# Altium project Trabajo Final.PrjPcb (part 3 of 4)

## Sheet arm.SchDoc
size A4
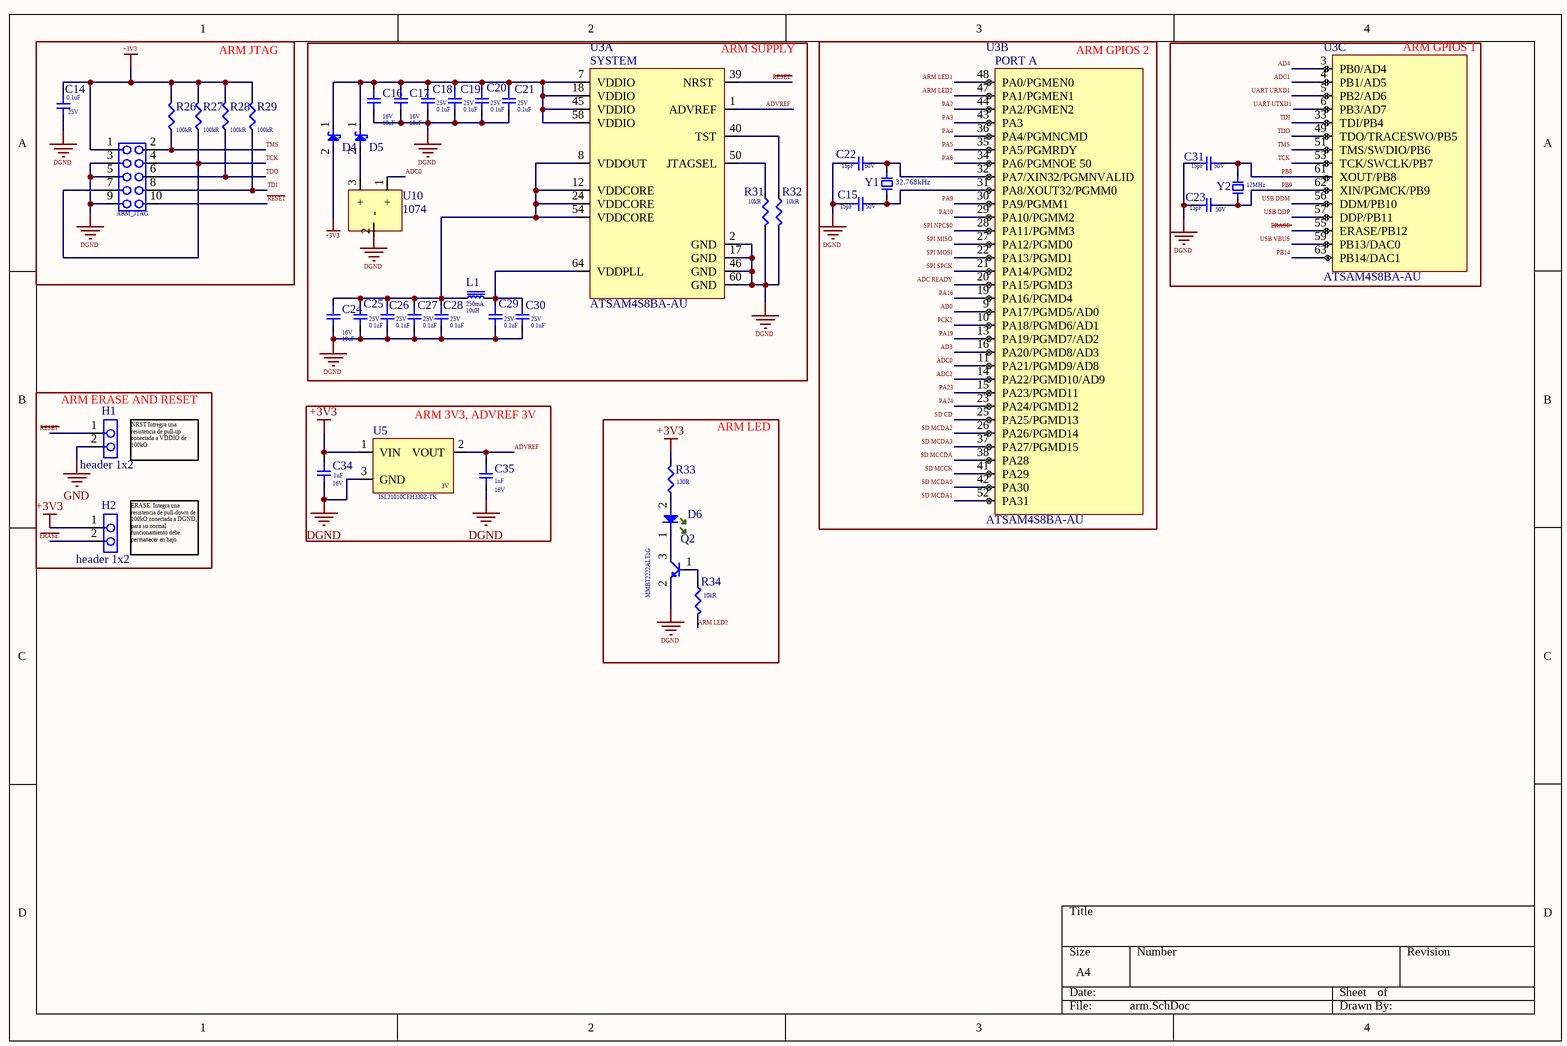
[diagram p3: arm.SchDoc]

### Parts
ARM_JTAG  20021121-00010C4LF  [conector jtag ok]  (value not drawn)
C14  Voltage Rating: 25V  Capacitance: 0.1uF  [CAP smd 0805 ok]  (hidden comment: CAP_CC0805KRX7R8BB104_YAGEO)
C15  Voltage Rating: 50V  Capacitance: 15pF  [CAP smd 0805 ok]  (hidden comment: CAP_C0805X150J5GACTU_KEMET)
C16  Voltage Rating: 16V  Capacitance: 10uF  [CAP smd 0805 OK]  (hidden comment: CAP_CL21A106KOCL3RC)
C17  Voltage Rating: 16V  Capacitance: 10uF  [CAP smd 0805 OK]  (hidden comment: CAP_CL21A106KOCL3RC)
C18  Voltage Rating: 25V  Capacitance: 0.1uF  [CAP smd 0805 ok]  (hidden comment: CAP_CC0805KRX7R8BB104_YAGEO)
C19  Voltage Rating: 25V  Capacitance: 0.1uF  [CAP smd 0805 ok]  (hidden comment: CAP_CC0805KRX7R8BB104_YAGEO)
C20  Voltage Rating: 25V  Capacitance: 0.1uF  [CAP smd 0805 ok]  (hidden comment: CAP_CC0805KRX7R8BB104_YAGEO)
C21  Voltage Rating: 25V  Capacitance: 0.1uF  [CAP smd 0805 ok]  (hidden comment: CAP_CC0805KRX7R8BB104_YAGEO)
C22  Voltage Rating: 50V  Capacitance: 15pF  [CAP smd 0805 ok]  (hidden comment: CAP_C0805X150J5GACTU_KEMET)
C23  Voltage Rating: 50V  Capacitance: 15pF  [CAP smd 0805 ok]  (hidden comment: CAP_C0805X150J5GACTU_KEMET)
C24  Voltage Rating: 16V  Capacitance: 10uF  [CAP smd 0805 OK]  (hidden comment: CAP_CL21A106KOCL3RC)
C25  Voltage Rating: 25V  Capacitance: 0.1uF  [CAP smd 0805 ok]  (hidden comment: CAP_CC0805KRX7R8BB104_YAGEO)
C26  Voltage Rating: 25V  Capacitance: 0.1uF  [CAP smd 0805 ok]  (hidden comment: CAP_CC0805KRX7R8BB104_YAGEO)
C27  Voltage Rating: 25V  Capacitance: 0.1uF  [CAP smd 0805 ok]  (hidden comment: CAP_CC0805KRX7R8BB104_YAGEO)
C28  Voltage Rating: 25V  Capacitance: 0.1uF  [CAP smd 0805 ok]  (hidden comment: CAP_CC0805KRX7R8BB104_YAGEO)
C29  Voltage Rating: 25V  Capacitance: 0.1uF  [CAP smd 0805 ok]  (hidden comment: CAP_CC0805KRX7R8BB104_YAGEO)
C30  Voltage Rating: 25V  Capacitance: 0.1uF  [CAP smd 0805 ok]  (hidden comment: CAP_CC0805KRX7R8BB104_YAGEO)
C31  Voltage Rating: 50V  Capacitance: 15pF  [CAP smd 0805 ok]  (hidden comment: CAP_C0805X150J5GACTU_KEMET)
C34  Voltage Rating: 16V  Capacitance: 1uF  [CAP smd 0805 ok]  (hidden comment: CAP_CC0805KKX7R7BB105_YAGEO)
C35  Voltage Rating: 16V  Capacitance: 1uF  [CAP smd 0805 ok]  (hidden comment: CAP_CC0805KKX7R7BB105_YAGEO)
D4  DB2J20900L  [Diode SMini2 ok]  (value not drawn)
D5  DB2J20900L  [Diode SMini2 ok]  (value not drawn)
D6  150080VS75000  [Diode smd 0805 green ok]  (value not drawn)
H1  header 1x2
H2  header 1x2
L1  Current Rating: 250mA  Inductance: 10uH  [Inductor smd 1812 ok]  (hidden comment: CM453232-100KL)
Q2  MMBT2222ALT1G  [transistor led ok]
R26  Resistance: 100kR  [res 0805 ok]  (hidden comment: AC0805JR-07100KL)
R27  Resistance: 100kR  [res 0805 ok]  (hidden comment: AC0805JR-07100KL)
R28  Resistance: 100kR  [res 0805 ok]  (hidden comment: AC0805JR-07100KL)
R29  Resistance: 100kR  [res 0805 ok]  (hidden comment: AC0805JR-07100KL)
R31  Resistance: 10kR  [res 0805 ok]  (hidden comment: RC0805JR-0710KL)
R32  Resistance: 10kR  [res 0805 ok]  (hidden comment: RC0805JR-0710KL)
R33  Resistance: 130R  [res 0805 ok]  (hidden comment: RC0805FR-07130RL)
R34  Resistance: 10kR  [res 0805 ok]  (hidden comment: RC0805JR-0710KL)
U3  ATSAM4S8BA-AU  [arm ok]  (parts A,B,C of 3)
U5  Reference Voltage: 3V  [3v reference ok]  (hidden comment: ISL21010CFH330Z-TK)
U10  1074  [pila]
Y1  Frequency: 32.768kHz  [clk 32k ok]  (hidden comment: ECS-.327-12.5-34S-TR)
Y2  Frequency: 12MHz  [clk 12M ok]  (hidden comment: ECS-120-20-3X-TR)

### Blocks framed on the sheet
ARM JTAG: ARM_JTAG C14 R26-R29
ARM SUPPLY: C16-C21 C24-C30 D4 D5 L1 R31 R32 U3 U10
ARM GPIOS 2: C15 C22 U3 Y1
ARM GPIOS 1: C23 C31 U3 Y2
ARM ERASE AND RESET: H1 H2
ARM 3V3, ADVREF 3V: C34 C35 U5
ARM LED: D6 Q2 R33 R34

### Nets
+3V3: ARM_JTAG.1 C14.23 C34.23 D4.2 H2.1 R26.2 R27.2 R28.2 R29.2 R33.2 U5.1(VIN)
DGND: ARM_JTAG.3 ARM_JTAG.5 ARM_JTAG.9 C14.22 C15.23 C16.22 C17.22 C18.22 C19.22 C20.22 C21.22 C22.23 C23.23 C24.22 C25.22 C26.22 C27.22 C28.22 C29.22 C30.22 C31.22 C34.22 C35.22 Q2.2 R31.1 R32.1 U3.2(GND) U3.17(GND) U3.46(GND) U3.60(GND) U5.3(GND)  [project net AGND]
GND: H1.2
AD0: U3.9(PA17/PGMD5/AD0)
AD3: U3.16(PA20/PGMD8/AD3)
AD4: U3.3(PB0/AD4)
ADC0: U3.11(PA21/PGMD9/AD8) U10.1(+)
ADC1: U3.4(PB1/AD5)
ADC2: U3.14(PA22/PGMD10/AD9)
ADC READY: U3.20(PA15/PGMD3)
ADVREF: C35.23 U3.1(ADVREF) U5.2(VOUT)
ARM LED1: U3.48(PA0/PGMEN0)
ARM LED2: R34.1 U3.47(PA1/PGMEN1)
ERASE: H2.2 U3.55(ERASE/PB12)
PA2: U3.44(PA2/PGMEN2)
PA3: U3.43(PA3)
PA4: U3.36(PA4/PGMNCMD)
PA5: U3.35(PA5/PGMRDY)
PA6: U3.34(PA6/PGMNOE_50)
PA9: U3.30(PA9/PGMM1)
PA10: U3.29(PA10/PGMM2)
PA16: U3.19(PA16/PGMD4)
PA19: U3.13(PA19/PGMD7/AD2)
PA23: U3.15(PA23/PGMD11)
PA24: U3.23(PA24/PGMD12)
PB8: C31.23 U3.61(XOUT/PB8) Y2.14
PB9: C23.22 U3.62(XIN/PGMCK/PB9) Y2.13
PB14: U3.63(PB14/DAC1)
PCK2: U3.10(PA18/PGMD6/AD1)
RESET: ARM_JTAG.10 H1.1 U3.39(NRST)
SD CD: U3.25(PA25/PGMD13)
SD MCCDA: U3.38(PA28)
SD MCCK: U3.41(PA29)
SD MCDA0: U3.42(PA30)
SD MCDA1: U3.52(PA31)
SD MCDA2: U3.26(PA26/PGMD14)
SD MCDA3: U3.37(PA27/PGMD15)
SPI MISO: U3.27(PA12/PGMD0)
SPI MOSI: U3.22(PA13/PGMD1)
SPI NPCS0: U3.28(PA11/PGMM3)
SPI SPCK: U3.21(PA14/PGMD2)
TCK: ARM_JTAG.4 ARM_JTAG.7 R27.1 U3.53(TCK/SWCLK/PB7)
TDI: ARM_JTAG.8 R29.1 U3.33(TDI/PB4)
TDO: ARM_JTAG.6 R28.1 U3.49(TDO/TRACESWO/PB5)
TMS: ARM_JTAG.2 R26.1 U3.51(TMS/SWDIO/PB6)
UART URXD1: U3.5(PB2/AD6)
UART UTXD1: U3.6(PB3/AD7)
USB DDM: U3.56(DDM/PB10)
USB DDP: U3.57(DDP/PB11)
USB VBUS: U3.59(PB13/DAC0)
NetC15_22: C15.22 U3.31(PA8/XOUT32/PGMM0) Y1.13
NetC16_23: C16.23 C17.23 C18.23 C19.23 C20.23 C21.23 D4.1 D5.1 U3.7(VDDIO) U3.18(VDDIO) U3.45(VDDIO) U3.58(VDDIO)
NetC22_22: C22.22 U3.32(PA7/XIN32/PGMNVALID) Y1.14
NetC24_23: C24.23 C25.23 C26.23 C27.23 C28.23 L1.1 U3.8(VDDOUT) U3.12(VDDCORE) U3.24(VDDCORE) U3.54(VDDCORE)
NetC29_23: C29.23 C30.23 L1.2 U3.64(VDDPLL)
NetD5_2: D5.2 U10.3(+)
NetD6_1: D6.1 Q2.3
NetD6_2: D6.2 R33.1
NetQ2_1: Q2.1 R34.2
NetR31_2: R31.2 U3.50(JTAGSEL)
NetR32_2: R32.2 U3.40(TST)

Not connected (* = marked no-connect by the designer): U10 2(-)

### Notes on the sheet
- (near H1) NRST:Intregra una resistencia de pull-up conectada a VDDIO de 100kO
- (near H2) ERASE: Integra una resistencia de pull-down de 100kO conectada a DGND, para su normal funcionamiento debe permanecer en bajo.
- Labels drawn without touching a wire or pin: DGND
- (in symbol ATSAM4S8BA-AU, part A) SYSTEM
- (in symbol ATSAM4S8BA-AU, part B) PORT A

### Library data of the parts
ARM_JTAG = 20021121-00010C4LF: Conn Unshrouded Header HDR 10 POS 1.27mm Solder ST Top Entry SMD Minitek127® T/R; Manufacturer 1: Amphenol ICC / FCI; Supplier 1: Digi-Key; Manufacturer Part Number 1: 20021121-00010C4LF; Stock 1: 0; Pricing 1: 1=0,91000, 10=0,76900, 100=0,69070 (USD); RoHS: No; ComponentLink1URL: https://datasheet.ciiva.com/11749/0900766b8118d62a-11749057.pdf?src-supplier=RSComponents; ComponentLink1Description: https://datasheet.ciiva.com/11749/0900766b8118d62a-11749057.pdf?src-supplier=RSComponents; Supplier Part Number 1: 609-3695-1-ND
C14 C18-C21 C25-C30 = CAP_CC0805KRX7R8BB104_YAGEO: CAPACITOR, 0805, 100NF, 25V, REEL 4000; Manufacturer 1: Yageo; Material: Ceramic; Tolerance: 10%; Dielectric: X7R; Insulation Resistance: 100GR; Supplier 1: Digi-Key; Manufacturer Part Number 1: CC0805KRX7R8BB104; Stock 1: 278639; Pricing 1: 1=0,12000, 10=0,08800, 50=0,04980, 100=0,04130, 500=0,02894, 1000=0,02396 (USD); RoHS: Yes; Mount: Surface Mount; Case/Package: 0805; Number of Pins: 2; Case Code (Metric): 2012; Case Code (Imperial): 0805; Min Operating Temperature: -55°C; Max Operating Temperature: 125°C; Package Quantity: 1; Packaging: Tape and Reel; Voltage Rating (DC): 25V; Termination: SMD/SMT; Resistor Type: Ceramic; Series: CC; Length: 2mm; Width: 0.049inch; Height: 0.85mm; Thickness: 0.033inch; Depth: 1.25mm; Radiation Hardening: No; REACH SVHC: No SVHC; Lead Free: Lead Free; Halogen Free: Halogen Free; RoHS Compliant: Yes; ComponentLink1URL: https://datasheet.ciiva.com/8034/70765-8034031.pdf?src-supplier=Element14; ComponentLink1Description: https://datasheet.ciiva.com/8034/70765-8034031.pdf?src-supplier=Element14; ComponentLink2URL: https://datasheet.ciiva.com/28450/1489800-28450789.pdf?src-supplier=Element14; ComponentLink2Description: https://datasheet.ciiva.com/28450/1489800-28450789.pdf?src-supplier=Element14; ComponentLink3URL: https://datasheet.ciiva.com/46430/1850775-46430166.pdf?src-supplier=Element14; ComponentLink3Description: https://datasheet.ciiva.com/46430/1850775-46430166.pdf?src-supplier=Element14; ComponentLink4URL: https://datasheet.ciiva.com/145/mlccorderingcode-145008.pdf?src-supplier=Digi-Key; ComponentLink4Description: https://datasheet.ciiva.com/145/mlccorderingcode-145008.pdf?src-supplier=Digi-Key; ComponentLink5URL: https://datasheet.ciiva.com/145/mlccorderingcode-145007.pdf?src-supplier=Digi-Key; ComponentLink5Description: https://datasheet.ciiva.com/145/mlccorderingcode-145007.pdf?src-supplier=Digi-Key; ComponentLink6URL: https://datasheet.ciiva.com/145/mlccorderingcode-145009.pdf?src-supplier=Digi-Key; ComponentLink6Description: https://datasheet.ciiva.com/145/mlccorderingcode-145009.pdf?src-supplier=Digi-Key; ComponentLink7URL: https://datasheet.ciiva.com/8034/1784427-8034030.pdf?src-supplier=Element14; ComponentLink7Description: https://datasheet.ciiva.com/8034/1784427-8034030.pdf?src-supplier=Element14; ComponentLink8URL: https://datasheet.ciiva.com/8034/1784427-8034029.pdf?src-supplier=Element14; ComponentLink8Description: https://datasheet.ciiva.com/8034/1784427-8034029.pdf?src-supplier=Element14; ComponentLink9URL: https://datasheet.ciiva.com/15189/getdatasheetpartid-330244-15189223.pdf?src-supplier=Verical; ComponentLink9Description: https://datasheet.ciiva.com/15189/getdatasheetpartid-330244-15189223.pdf?src-supplier=Verical; ComponentLink10URL: https://datasheet.ciiva.com/16625/upy-gphc-x7r-6-3v-to-50v-8-16625546.pdf?src-supplier=Avnet+Europe; ComponentLink10Description: https://datasheet.ciiva.com/16625/upy-gphc-x7r-6-3v-to-50v-8-16625546.pdf?src-supplier=Avnet+Europe; Supplier Part Number 1: 311-1141-1-ND
C15 C22 C23 C31 = CAP_C0805X150J5GACTU_KEMET: Multilayer Ceramic Capacitors MLCC - SMD/SMT 50volts 15pF 5% C0G; Manufacturer 1: KEMET; Supplier 1: Digi-Key; Manufacturer Part Number 1: C0805X150J5GACTU; Stock 1: 2348; Pricing 1: 1=0,33000, 10=0,23100, 50=0,16160, 100=0,13860, 500=0,10396, 1000=0,08778 (USD); RoHS: Yes; Mount: Surface Mount; Case/Package: 0805; Case Code (Imperial): 0805; Case Code (Metric): 2012; Dielectric Material: Ceramic; Min Operating Temperature: -55°C; Max Operating Temperature: 125°C; Package Quantity: 4000; Voltage Rating (DC): 50V; Tolerance: 5%; Packaging: Tape and Reel; Dielectric: C0G; Termination: SMD/SMT; Series: FT-CAP; Features: Soft Termination; Construction: Flat; Length: 0.083inch; Width: 1.25mm; Height: 0.78mm; Thickness: 0.035inch; Depth: 1.25mm; Radiation Hardening: No; RoHS Compliant: Yes; Lead Free: Lead Free; ComponentLink1URL: http://www.mouser.com/ds/2/212/KEM_C1062_C0G_FT-CAP_SMD-1101746.pdf?src-supplier=Mouser; ComponentLink1Description: http://www.mouser.com/ds/2/212/KEM_C1062_C0G_FT-CAP_SMD-1101746.pdf?src-supplier=Mouser; ComponentLink2URL: http://www.kemet.com/kemet/web/homepage/kechome.nsf/file/KEM_C1062_C0G_FT-CAP_SMD.pdf/$file/KEM_C1062_C0G_FT-CAP_SMD.pdf?src-supplier=Avnet; ComponentLink2Description: http://www.kemet.com/kemet/web/homepage/kechome.nsf/file/KEM_C1062_C0G_FT-CAP_SMD.pdf/$file/KEM_C1062_C0G_FT-CAP_SMD.pdf?src-supplier=Avnet; ComponentLink3URL: https://search.kemet.com/component-edge/download/specsheet/C0805X150J5GACTU.pdf?src-supplier=Digi-Key; ComponentLink3Description: https://search.kemet.com/component-edge/download/specsheet/C0805X150J5GACTU.pdf?src-supplier=Digi-Key; Supplier Part Number 1: 399-7428-1-ND
C16 C17 C24 = CAP_CL21A106KOCL3RC: CAP CER 10UF 16V X5R 0805; Manufacturer 1: Samsung; Tolerance: 10%; Supplier 1: Digi-Key; Manufacturer Part Number 1: CL21A106KOCL3RC; Stock 1: 0; RoHS: Yes; Mount: Surface Mount; Case/Package: 0805; Case Code (Metric): 2012; Case Code (Imperial): 0805; Min Operating Temperature: -55°C; Max Operating Temperature: 85°C; Package Quantity: 1; Packaging: Tape and Reel; Series: CL; Length: 0.079inch; Width: 0.049inch; Thickness: 0.037inch; RoHS Compliant: Yes; ComponentLink1URL: https://datasheet.ciiva.com/25796/cl21a106kocl3rc-25796224.pdf?src-supplier=Digi-Key; ComponentLink1Description: https://datasheet.ciiva.com/25796/cl21a106kocl3rc-25796224.pdf?src-supplier=Digi-Key; Supplier Part Number 1: 1276-2398-2-ND
C34 C35 = CAP_CC0805KKX7R7BB105_YAGEO: YAGEO   CC0805KKX7R7BB105   CERAMIC CAPACITOR, 1UF, 16V, X7R, 10%, 0805; Supplier 1: Digi-Key; Manufacturer 1: Yageo; Manufacturer Part Number 1: CC0805KKX7R7BB105; Stock 1: 516899; Pricing 1: 1=0,16000, 10=0,11700, 50=0,06640, 100=0,05500, 500=0,03858, 1000=0,03194 (USD); RoHS: Yes; Mount: Surface Mount; Case/Package: 0805; Case Code (Metric): 2012; Case Code (Imperial): 0805; Min Operating Temperature: -55°C; Max Operating Temperature: 125°C; Tolerance: 10%; Dielectric: X7R; Series: CC; Packaging: Tape and Reel; Package Quantity: 1; Termination: SMD/SMT; Voltage Rating (DC): 16V; Length: 2mm; Width: 0.049inch; Depth: 1.25mm; Thickness: 0.049inch; Radiation Hardening: No; REACH SVHC: No SVHC; Lead Free: Lead Free; Halogen Free: Halogen Free; RoHS Compliant: Yes; ComponentLink1URL: https://datasheet.ciiva.com/144/mlccorderingcode-144902.pdf?src-supplier=Digi-Key; ComponentLink1Description: https://datasheet.ciiva.com/144/mlccorderingcode-144902.pdf?src-supplier=Digi-Key; ComponentLink2URL: https://datasheet.ciiva.com/144/mlccorderingcode-144903.pdf?src-supplier=Digi-Key; ComponentLink2Description: https://datasheet.ciiva.com/144/mlccorderingcode-144903.pdf?src-supplier=Digi-Key; ComponentLink3URL: https://datasheet.ciiva.com/144/mlccorderingcode-144904.pdf?src-supplier=Digi-Key; ComponentLink3Description: https://datasheet.ciiva.com/144/mlccorderingcode-144904.pdf?src-supplier=Digi-Key; ComponentLink4URL: https://datasheet.ciiva.com/11464/upy-gphc-x7r-6-3v-to-50v-8-11464750.pdf?src-supplier=Avnet; ComponentLink4Description: https://datasheet.ciiva.com/11464/upy-gphc-x7r-6-3v-to-50v-8-11464750.pdf?src-supplier=Avnet; ComponentLink5URL: https://datasheet.ciiva.com/13173/upy-gp-np0-16v-to-50v-8-3714-13173254.pdf?src-supplier=Mouser; ComponentLink5Description: https://datasheet.ciiva.com/13173/upy-gp-np0-16v-to-50v-8-3714-13173254.pdf?src-supplier=Mouser; ComponentLink6URL: https://datasheet.ciiva.com/7978/1489800-7978201.pdf?src-supplier=Element14; ComponentLink6Description: https://datasheet.ciiva.com/7978/1489800-7978201.pdf?src-supplier=Element14; ComponentLink7URL: https://datasheet.ciiva.com/28450/1489800-28450750.pdf?src-supplier=Element14; ComponentLink7Description: https://datasheet.ciiva.com/28450/1489800-28450750.pdf?src-supplier=Element14; ComponentLink8URL: https://datasheet.ciiva.com/15189/getdatasheetpartid-251802-15189206.pdf?src-supplier=Verical; ComponentLink8Description: https://datasheet.ciiva.com/15189/getdatasheetpartid-251802-15189206.pdf?src-supplier=Verical; Supplier Part Number 1: 311-1365-1-ND
D4 D5 = DB2J20900L: PANASONIC - DB2J20900L - Schottky Rectifier, 20 V, 500 mA, Single, SOD-323F, 2 Pins, 500 mV; Manufacturer 1: Panasonic SSG; Max Reverse Current: 30uA; Forward Current: 500mA; Reverse Recovery Time: 2.4ns; Max Repetitive Reverse Voltage (Vrrm): 20V; Max Forward Surge Current (Ifsm): 3A; Forward Voltage: 500mV; Supplier 1: Allied Electronics; Manufacturer Part Number 1: DB2J20900L; Stock 1: 0; Pricing 1: 1=0,17400, 100=0,16600, 200=0,15100, 400=0,13600, 1000=0,12100 (USD); RoHS: Yes; Mount: Surface Mount; Number of Pins: 2; Contact Plating: Tin; Min Operating Temperature: -55°C; Max Operating Temperature: 125°C; Package Quantity: 1; Packaging: Tape and Reel; Average Rectified Current: 500mA; Peak Non-Repetitive Surge Current: 3A; Element Configuration: Single; Max Reverse Voltage (DC): 20V; Length: 1.7mm; Width: 1.25mm; Height: 0.7mm; REACH SVHC: Unknown; Lead Free: Lead Free; RoHS Compliant: Yes; ComponentLink1URL: https://datasheet.ciiva.com/7964/db2j209-bed-7964194.pdf?src-supplier=Element14; ComponentLink1Description: https://datasheet.ciiva.com/7964/db2j209-bed-7964194.pdf?src-supplier=Element14; ComponentLink2URL: https://datasheet.ciiva.com/22650/db2j209-bed-22650026.pdf?src-supplier=Farnell; ComponentLink2Description: https://datasheet.ciiva.com/22650/db2j209-bed-22650026.pdf?src-supplier=Farnell; ComponentLink3URL: https://datasheet.ciiva.com/22659/1912053-22659242.pdf?src-supplier=Element14; ComponentLink3Description: https://datasheet.ciiva.com/22659/1912053-22659242.pdf?src-supplier=Element14; Supplier Part Number 1: 70358466
D6 = 150080VS75000: LED GREEN CLEAR 0805 SMD; Manufacturer 1: Wurth Electronics; Luminous Intensity: 40mcd; Forward Current: 30mA; Forward Voltage: 2V; Viewing Angle: 140°; Wavelength: 570nm; Lens Style: Clear,Rectangular; Test Current: 20mA; Supplier 1: RSComponents; Manufacturer Part Number 1: 150080VS75000; Stock 1: 13900; Pricing 1: 500=0,09600, 1000=0,09200, 2000=0,08700, 4000=0,08300 (GBP); RoHS: Yes; Mount: Surface Mount; Case/Package: 0805; Color: Green; Case Code (Metric): 2012; Case Code (Imperial): 0805; Min Operating Temperature: -40°C; Max Operating Temperature: 85°C; Package Quantity: 4000; Packaging: Tape and Reel; Dominant Wavelength: 570nm; Length: 2mm; Width: 1.25mm; Height: 0.7mm; REACH SVHC: Unknown; ComponentLink1URL: https://datasheet.ciiva.com/22656/150080vs75000-22656966.pdf?src-supplier=Element14; ComponentLink1Description: https://datasheet.ciiva.com/22656/150080vs75000-22656966.pdf?src-supplier=Element14; ComponentLink2URL: https://datasheet.ciiva.com/29279/759437-da-01-en-chipled-0805-w-kl-h-gruen-150080vs7500-29279047.pdf?src-supplier=Conrad; ComponentLink2Description: https://datasheet.ciiva.com/29279/759437-da-01-en-chipled-0805-w-kl-h-gruen-150080vs7500-29279047.pdf?src-supplier=Conrad; ComponentLink3URL: https://datasheet.ciiva.com/29563/150080vs75000-29563018.pdf?src-supplier=Digi-Key; ComponentLink3Description: https://datasheet.ciiva.com/29563/150080vs75000-29563018.pdf?src-supplier=Digi-Key; Supplier Part Number 1: 8154237P
L1 = CM453232-100KL: Ind General Purpose Chip Wirewound 10uH 10% 2.52MHz 50Q-Factor Ferrite 250mA 1812 T/R; Manufacturer 1: Bourns; DC Resistance (DCR): 1.6R; Q Factor: 50; Self Resonant Frequency: 20MHz; Shielding: Unshielded; Current: 160mA; Supplier 1: Digi-Key; Manufacturer Part Number 1: CM453232-100KL; Stock 1: 1374; Pricing 1: 1=0,43000, 10=0,38100, 25=0,33320, 50=0,28540, 100=0,26170, 250=0,23788 (USD); RoHS: Yes; Mount: Surface Mount; Case/Package: 1812; Number of Pins: 2; Core Material: Ferrite; Case Code (Metric): 4532; Case Code (Imperial): 1812; Contact Plating: Tin; Min Operating Temperature: -40°C; Max Operating Temperature: 100°C; Tolerance: 10%; Max DC Current: 250mA; Packaging: Tape and Reel; Inductance Tolerance: 10%; Package Quantity: 500; Resistor Type: Wirewound; Test Frequency: 2.52MHz; Termination: SMD/SMT; DC Current: 250mA; Series Resistance: 1.6R; Series: CM453232; Length: 4.8mm; Width: 0.126inch; Height: 3mm; Height - Seated (Max): 0.134inch; Depth: 3.4mm; Radiation Hardening: No; REACH SVHC: No SVHC; Military Standard: Not; RoHS Compliant: Yes; ComponentLink1URL: https://datasheet.ciiva.com/27049/774461-27049974.pdf?src-supplier=Jameco; ComponentLink1Description: https://datasheet.ciiva.com/27049/774461-27049974.pdf?src-supplier=Jameco; ComponentLink2URL: https://datasheet.ciiva.com/11799/0900766b81218b74-11799714.pdf?src-supplier=RSComponents; ComponentLink2Description: https://datasheet.ciiva.com/11799/0900766b81218b74-11799714.pdf?src-supplier=RSComponents; ComponentLink3URL: https://datasheet.ciiva.com/29348/447189-da-01-en-induktivitaet-cm453232-100kl-10uh-250ma-29348045.pdf?src-supplier=Conrad; ComponentLink3Description: https://datasheet.ciiva.com/29348/447189-da-01-en-induktivitaet-cm453232-100kl-10uh-250ma-29348045.pdf?src-supplier=Conrad; ComponentLink4URL: https://datasheet.ciiva.com/3081/cm-3081727.pdf?src-supplier=Avnet; ComponentLink4Description: https://datasheet.ciiva.com/3081/cm-3081727.pdf?src-supplier=Avnet; ComponentLink5URL: https://datasheet.ciiva.com/6689/cm-6689143.pdf?src-supplier=Digi-Key; ComponentLink5Description: https://datasheet.ciiva.com/6689/cm-6689143.pdf?src-supplier=Digi-Key; ComponentLink6URL: https://datasheet.ciiva.com/6689/cm-6689144.pdf?src-supplier=Digi-Key; ComponentLink6Description: https://datasheet.ciiva.com/6689/cm-6689144.pdf?src-supplier=Digi-Key; ComponentLink7URL: https://datasheet.ciiva.com/6689/cm-6689145.pdf?src-supplier=Digi-Key; ComponentLink7Description: https://datasheet.ciiva.com/6689/cm-6689145.pdf?src-supplier=Digi-Key; ComponentLink8URL: https://datasheet.ciiva.com/4978/cm-4978555.pdf?src-supplier=Mouser; ComponentLink8Description: https://datasheet.ciiva.com/4978/cm-4978555.pdf?src-supplier=Mouser; ComponentLink9URL: https://datasheet.ciiva.com/25903/cm-25903528.pdf?src-supplier=Avnet+Europe; ComponentLink9Description: https://datasheet.ciiva.com/25903/cm-25903528.pdf?src-supplier=Avnet+Europe; ComponentLink10URL: https://datasheet.ciiva.com/14124/wfcm-dat-e-14124666.pdf?src-supplier=Distrelec; ComponentLink10Description: https://datasheet.ciiva.com/14124/wfcm-dat-e-14124666.pdf?src-supplier=Distrelec; ComponentLink11URL: https://datasheet.ciiva.com/15225/getdatasheetpartid-128072-15225413.pdf?src-supplier=Verical; ComponentLink11Description: https://datasheet.ciiva.com/15225/getdatasheetpartid-128072-15225413.pdf?src-supplier=Verical; ComponentLink12URL: https://datasheet.ciiva.com/7839/1481743-7839005.pdf?src-supplier=Element14; ComponentLink12Description: https://datasheet.ciiva.com/7839/1481743-7839005.pdf?src-supplier=Element14; ComponentLink13URL: https://datasheet.ciiva.com/7839/1481743-7839006.pdf?src-supplier=Element14; ComponentLink13Description: https://datasheet.ciiva.com/7839/1481743-7839006.pdf?src-supplier=Element14; Supplier Part Number 1: CM453232-100KLCT-ND
Q2 = MMBT2222ALT1G: Trans GP BJT NPN 40V 0.6A 3-Pin SOT-23 T/R; Manufacturer 1: ON Semiconductor; Power Dissipation: 300mW; Collector Base Voltage (VCBO): 75V; Emitter Base Voltage (VEBO): 6V; Max Collector Current: 600mA; Element Configuration: Single; Gain Bandwidth Product: 300MHz; hFE Min: 100; Number of Elements: 1; Collector Emitter Saturation Voltage: 1V; Type: General Purpose; Supplier 1: Digi-Key; Stock 1: 0; Pricing 1: 1=0,16000, 10=0,14800, 100=0,08030, 500=0,04944, 1000=0,03371 (USD); RoHS: Yes; Case/Package: SOT-23-3; Number of Pins: 3; Contact Plating: Tin,Matte; Min Operating Temperature: -55°C; Max Operating Temperature: 150°C; Packaging: Tape and Reel; Polarity: NPN; Collector Emitter Voltage (VCEO): 40V; Collector Emitter Breakdown Voltage: 40V; Max Power Dissipation: 300mW; Package Quantity: 1; Frequency: 300MHz; Transition Frequency: 300MHz; Voltage Rating (DC): 40V; Current Rating: 600mA; Collector-emitter Voltage-Max: 1V; Series: -; Max Breakdown Voltage: 40V; Max Frequency: 300MHz; Length: 2.9mm; Width: 1.3mm; Height: 0.94mm; Radiation Hardening: No; Lead Free: Lead Free; REACH SVHC: No SVHC; ComponentLink1URL: https://datasheet.ciiva.com/16199/mmbt2222lt1-d-16199072.pdf?src-supplier=Future+Electronics; ComponentLink1Description: https://datasheet.ciiva.com/16199/mmbt2222lt1-d-16199072.pdf?src-supplier=Future+Electronics; ComponentLink2URL: https://datasheet.ciiva.com/15139/getdatasheetpartid-82691-15139077.pdf?src-supplier=Verical; ComponentLink2Description: https://datasheet.ciiva.com/15139/getdatasheetpartid-82691-15139077.pdf?src-supplier=Verical; ComponentLink3URL: https://datasheet.ciiva.com/976/mmbt2222lt1-d-976344.pdf?src-supplier=Digi-Key; ComponentLink3Description: https://datasheet.ciiva.com/976/mmbt2222lt1-d-976344.pdf?src-supplier=Digi-Key; ComponentLink4URL: https://datasheet.ciiva.com/976/mmbt2222lt1-d-976345.pdf?src-supplier=Digi-Key; ComponentLink4Description: https://datasheet.ciiva.com/976/mmbt2222lt1-d-976345.pdf?src-supplier=Digi-Key; ComponentLink5URL: https://datasheet.ciiva.com/976/mmbt2222lt1-d-976346.pdf?src-supplier=Digi-Key; ComponentLink5Description: https://datasheet.ciiva.com/976/mmbt2222lt1-d-976346.pdf?src-supplier=Digi-Key; ComponentLink6URL: https://datasheet.ciiva.com/11201/mmbt2222lt1-d-11201869.pdf?src-supplier=Avnet; ComponentLink6Description: https://datasheet.ciiva.com/11201/mmbt2222lt1-d-11201869.pdf?src-supplier=Avnet; ComponentLink7URL: https://datasheet.ciiva.com/25998/mmbt2222lt1-d-25998815.pdf?src-supplier=Avnet+Europe; ComponentLink7Description: https://datasheet.ciiva.com/25998/mmbt2222lt1-d-25998815.pdf?src-supplier=Avnet+Europe; ComponentLink8URL: https://datasheet.ciiva.com/7972/mmbt2222lt1-d-7972057.pdf?src-supplier=Element14; ComponentLink8Description: https://datasheet.ciiva.com/7972/mmbt2222lt1-d-7972057.pdf?src-supplier=Element14; ComponentLink9URL: https://datasheet.ciiva.com/7972/mmbt2222lt1-d-7972058.pdf?src-supplier=Element14; ComponentLink9Description: https://datasheet.ciiva.com/7972/mmbt2222lt1-d-7972058.pdf?src-supplier=Element14; ComponentLink10URL: https://datasheet.ciiva.com/14546/70099528-14546715.pdf?src-supplier=Allied+Electronics; ComponentLink10Description: https://datasheet.ciiva.com/14546/70099528-14546715.pdf?src-supplier=Allied+Electronics; Supplier Part Number 1: MMBT2222ALT1GOSCT-ND; Manufacturer Part Number 1: MMBT2222ALT1G
R26-R29 = AC0805JR-07100KL: Thick Film Resistors - SMD 0805  100K ohm 5% 1/8W; Manufacturer 1: Yageo; Power Rating: 125mW; Voltage Rating: 150V; Temperature Coefficient: 100ppm/°C; Supplier 1: Digi-Key; Manufacturer Part Number 1: AC0805JR-07100KL; Stock 1: 23; Pricing 1: 1=0,10000, 10=0,04300, 100=0,01730, 1000=0,00777, 2500=0,00674 (USD); RoHS: Yes; Case/Package: 0805; Case Code (Imperial): 0805; Case Code (Metric): 2012; Weight: 0.000194oz; Min Operating Temperature: -55°C; Max Operating Temperature: 155°C; Tolerance: 5%; Packaging: Tape and Reel; Resistor Type: Thick Film; Number of Terminations: 2; Termination: SMD/SMT; Max Power Dissipation: 125mW; Features: Moisture Resistant,Automotive AEC-Q200; Series: AC; Length: 0.079inch; Width: 0.049inch; Height: 0.024inch; RoHS Compliant: Yes; ComponentLink1URL: https://datasheet.ciiva.com/12576/pyu-ac-51-rohs-l-2-12576604.pdf?src-supplier=Mouser; ComponentLink1Description: https://datasheet.ciiva.com/12576/pyu-ac-51-rohs-l-2-12576604.pdf?src-supplier=Mouser; Supplier Part Number 1: YAG3756CT-ND
R31 R32 R34 = RC0805JR-0710KL: Res Thick Film smd 0805 10K Ohm 5% 1/8W; Manufacturer 1: Yageo; Power Rating: 125mW; Temperature Coefficient: 100ppm/°C; Voltage Rating: 150V; Supplier 1: Digi-Key; Manufacturer Part Number 1: RC0805JR-0710KL; Stock 1: 2124400; Pricing 1: 1=0,10000, 10=0,03600, 100=0,01450, 1000=0,00652, 2500=0,00566 (USD); RoHS: Yes; Case/Package: 0805; Contact Plating: Tin,Matte; Case Code (Imperial): 0805; Case Code (Metric): 2012; Size Code: 0805; Min Operating Temperature: -55°C; Max Operating Temperature: 155°C; Resistor Type: Thick Film; Tolerance: 5%; Packaging: Tape and Reel; Termination: SMD/SMT; Features: Moisture Resistant; Series: RC; Max Power Dissipation: 125mW; Number of Terminations: 2; Resistance Tolerance: 5%; Construction: Rectangular; Length: 2mm; Width: 1.25mm; Height: 0.5mm; Depth: 1.25mm; Radiation Hardening: No; RoHS Compliant: Yes; REACH SVHC: Unknown; Military Standard: Not; Lead Free: Lead Free; ComponentLink1URL: https://datasheet.ciiva.com/7941/444164-7941870.pdf?src-supplier=Element14; ComponentLink1Description: https://datasheet.ciiva.com/7941/444164-7941870.pdf?src-supplier=Element14; ComponentLink2URL: https://datasheet.ciiva.com/7941/444164-7941871.pdf?src-supplier=Element14; ComponentLink2Description: https://datasheet.ciiva.com/7941/444164-7941871.pdf?src-supplier=Element14; ComponentLink3URL: https://datasheet.ciiva.com/7983/444164-7983765.pdf?src-supplier=Element14; ComponentLink3Description: https://datasheet.ciiva.com/7983/444164-7983765.pdf?src-supplier=Element14; Supplier Part Number 1: 311-10KARCT-ND
R33 = RC0805FR-07130RL: Res Thick Film smd 0805 130 Ohm 1% 0.125W(; Manufacturer 1: Yageo; Power Rating: 125mW; Voltage Rating: 150V; Temperature Coefficient: 100ppm/°C; Supplier 1: Digi-Key; Manufacturer Part Number 1: RC0805FR-07130RL; Stock 1: 289647; Pricing 1: 1=0,10000, 10=0,04200, 100=0,01690, 1000=0,00759, 2500=0,00659 (USD); RoHS: Yes; Mount: Surface Mount; Case/Package: 0805; Case Code (Metric): 2012; Case Code (Imperial): 0805; Size Code: 0805; Min Operating Temperature: -55°C; Max Operating Temperature: 155°C; Tolerance: 1%; Package Quantity: 1; Packaging: Tape and Reel; Resistor Type: Thick Film; Number of Terminations: 2; Termination: SMD/SMT; Max Power Dissipation: 125mW; Voltage Rating (DC): 150V; Features: Moisture Resistant; Series: RC; Technology: THICK FILM; Construction: Rectangular; Length: 2mm; Width: 0.049inch; Height: 0.5mm; Depth: 1.25mm; Military Standard: Not; Lead Free: Lead Free; RoHS Compliant: Yes; ComponentLink1URL: https://datasheet.ciiva.com/11808/0900766b8106beab-11808374.pdf?src-supplier=RSComponents; ComponentLink1Description: https://datasheet.ciiva.com/11808/0900766b8106beab-11808374.pdf?src-supplier=RSComponents; ComponentLink2URL: https://datasheet.ciiva.com/2457/pyu-r-int-thick-7-2457546.pdf?src-supplier=Digi-Key; ComponentLink2Description: https://datasheet.ciiva.com/2457/pyu-r-int-thick-7-2457546.pdf?src-supplier=Digi-Key; ComponentLink3URL: https://datasheet.ciiva.com/2457/pyu-r-int-thick-7-2457547.pdf?src-supplier=Digi-Key; ComponentLink3Description: https://datasheet.ciiva.com/2457/pyu-r-int-thick-7-2457547.pdf?src-supplier=Digi-Key; ComponentLink4URL: https://datasheet.ciiva.com/2457/pyu-r-int-thick-7-2457545.pdf?src-supplier=Digi-Key; ComponentLink4Description: https://datasheet.ciiva.com/2457/pyu-r-int-thick-7-2457545.pdf?src-supplier=Digi-Key; ComponentLink5URL: https://datasheet.ciiva.com/15189/getdatasheetpartid-326400-15189899.pdf?src-supplier=Verical; ComponentLink5Description: https://datasheet.ciiva.com/15189/getdatasheetpartid-326400-15189899.pdf?src-supplier=Verical; ComponentLink6URL: https://datasheet.ciiva.com/16746/rc0805-16746879.pdf?src-supplier=Future+Electronics; ComponentLink6Description: https://datasheet.ciiva.com/16746/rc0805-16746879.pdf?src-supplier=Future+Electronics; Supplier Part Number 1: 311-130CRCT-ND
U3 = ATSAM4S8BA-AU: MICROCONTROLLER MCU, 32 BIT, CORTEX-M4, 120MHZ, LQFP-64; Architecture:ARM Cortex-M4; CPU Speed:120MHz; Program Memory Size:512KB; RAM Memory Size:128KB; No. of Pins:64; MCU Case Style:LQFP; No. of I/Os:47; Supply Voltage Min:1.62V ;RoHS Compliant: Yes; Manufacturer 1: Microchip / Atmel; Min Supply Voltage: 1.62V; Max Supply Voltage: 3.6V; Number of PWM Channels: 4; RAM Size: 128KB; Number of Timers/Counters: 2; Number of ADC Channels: 11; Number of USB Channels: 1; Data Bus Width: 32b; Interface: I2C,SPI,USB,IrDA,MMC,UART,USART; Oscillator Type: Internal; Number of I/Os: 47; Max Frequency: 32MHz; Memory Type: FLASH,ROM; Memory Size: 512KB; Peripherals: Brown-out Detect/Reset,POR,PWM,WDT,DMA; Core Architecture: ARM; Supplier 1: Future Electronics; Manufacturer Part Number 1: ATSAM4S8BA-AU; Stock 1: 0; RoHS: Yes; Mount: Surface Mount; Case/Package: LQFP; Number of Pins: 64; Min Operating Temperature: -40°C; Max Operating Temperature: 85°C; Package Quantity: 160; Packaging: Tray; Frequency: 120MHz; Number of SPI Channels: 1; Number of I2C Channels: 2; Watchdog Timer: Yes; Number of UART Channels: 2; Series: SAM4S; Length: 12mm; Width: 10mm; Height: 1.6mm; Radiation Hardening: No; REACH SVHC: No SVHC; Lead Free: Lead Free; RoHS Compliant: Yes; ComponentLink1URL: https://datasheet.ciiva.com/12272/doc11100-52688-12272160.pdf?src-supplier=Mouser; ComponentLink1Description: https://datasheet.ciiva.com/12272/doc11100-52688-12272160.pdf?src-supplier=Mouser; ComponentLink2URL: https://datasheet.ciiva.com/30476/0900766b811a941e-30476054.pdf?src-supplier=RSComponents; ComponentLink2Description: https://datasheet.ciiva.com/30476/0900766b811a941e-30476054.pdf?src-supplier=RSComponents; ComponentLink3URL: https://datasheet.ciiva.com/8010/1653605-8010699.pdf?src-supplier=Element14; ComponentLink3Description: https://datasheet.ciiva.com/8010/1653605-8010699.pdf?src-supplier=Element14; Supplier Part Number 1: ATSAM4S8BA-AU-TRAY
U5 = ISL21010CFH330Z-TK: INTERSIL         ISL21010CFH330Z-TK             Voltage Reference, Precision Micropower, Series - Fixed, ISL21010 Series, 3V, SOT-23-3; Max Input Voltage: 6.5V; Max Output Current: 25mA; Tolerance: 0.2%; Number of Channels: 1; Temperature Coefficient: 50ppm/°C; Quiescent Current: 80uA; Max Supply Current: 100uA; Max Supply Voltage: 5.5V; Reference Type: Series,Fixed; Supplier 1: Avnet; Manufacturer 1: Intersil; Stock 1: 0; Pricing 1: 2000=0,81760, 4000=0,80080, 6000=0,78400, 10000=0,76720, 20000=0,75040, 100000=0,73360, 200000=0,71680 (USD); RoHS: Yes; Mount: Surface Mount; Case/Package: SOT-23; Number of Pins: 3; Min Operating Temperature: -40°C; Max Operating Temperature: 125°C; Output Voltage: 3V; Packaging: Tape and Reel; Package Quantity: 1000; Output Current: 25mA; Max Output Voltage: 3V; Series: ISL21010CFH330; Length: 2.92mm; Width: 1.3mm; Height: 0.91mm; Radiation Hardening: No; RoHS Compliant: Yes; REACH SVHC: No SVHC; ComponentLink1URL: https://datasheet.ciiva.com/1172/1599533-1172856.pdf?src-supplier=Element14; ComponentLink1Description: https://datasheet.ciiva.com/1172/1599533-1172856.pdf?src-supplier=Element14; Supplier Part Number 1: ISL21010CFH330Z-TK; Manufacturer Part Number 1: ISL21010CFH330Z-TK
U10 = 1074: Strain Relief Bushing; .437" Mounting Hole; Black; Manufacturer 1: Keystone Electronics; Supplier 1: Digi-Key; Manufacturer Part Number 1: 1074; Stock 1: 5773; Pricing 1: 1=0,66000, 25=0,57280, 100=0,46150, 250=0,42480, 500=0,39892, 1000=0,37305, 2500=0,34070, 5000=0,31483 (USD); RoHS: No; Supplier Part Number 1: 36-1074-ND
Y1 = ECS-.327-12.5-34S-TR: Crystal 0.032768MHz ±20ppm (Tol) 12.5pF Flexural 70000Ohm 2-Pin CSMD T/R; Manufacturer 1: ECS International; ESR (Equivalent Series Resistance): 70kR; Supplier 1: Digi-Key; Manufacturer Part Number 1: ECS-.327-12.5-34S-TR; Stock 1: 0; Pricing 1: 1=1,37000, 10=1,21400, 50=1,13520, 100=1,00320, 500=0,95040, 1000=0,79200 (USD); RoHS: Yes; Mount: Surface Mount; Case/Package: SMD/SMT; Number of Pins: 2; Min Operating Temperature: -40°C; Max Operating Temperature: 125°C; Package Quantity: 3000; Packaging: Tape and Reel; Frequency Tolerance: 20ppm; Load Capacitance: 12.5pF; Termination: SMD/SMT; Series: ECX-34S; Tolerance: 20ppm; Length: 0.126inch; Width: 1.5mm; Height: 0.035inch; Lead Pitch: 1.8mm; RoHS Compliant: Yes; Lead Free: Lead Free; ComponentLink1URL: https://datasheet.ciiva.com/15047/ecx-34s-15047020.pdf?src-supplier=Digi-Key; ComponentLink1Description: https://datasheet.ciiva.com/15047/ecx-34s-15047020.pdf?src-supplier=Digi-Key; ComponentLink2URL: https://datasheet.ciiva.com/15047/ecx-34s-15047021.pdf?src-supplier=Digi-Key; ComponentLink2Description: https://datasheet.ciiva.com/15047/ecx-34s-15047021.pdf?src-supplier=Digi-Key; ComponentLink3URL: https://datasheet.ciiva.com/15047/ecx-34s-15047022.pdf?src-supplier=Digi-Key; ComponentLink3Description: https://datasheet.ciiva.com/15047/ecx-34s-15047022.pdf?src-supplier=Digi-Key; Supplier Part Number 1: XC1967CT-ND
Y2 = ECS-120-20-3X-TR: CRYSTAL 12.0000MHZ 20PF SMD; Manufacturer 1: ECS International; Tolerance: 30ppm; ESR (Equivalent Series Resistance): 60R; Frequency Stability: 50ppm; Supplier 1: Digi-Key; Manufacturer Part Number 1: ECS-120-20-3X-TR; Stock 1: 16869; Pricing 1: 1=0,34000, 10=0,28800, 50=0,25880, 100=0,23000, 500=0,21850, 1000=0,18400 (USD); RoHS: Yes; Mount: Surface Mount; Number of Pins: 2; Min Operating Temperature: -10°C; Max Operating Temperature: 70°C; Package Quantity: 1; Load Capacitance: 20pF; Packaging: Tape and Reel; Frequency Tolerance: 30ppm; Termination: SMD/SMT; Series: CSM-3X; Length: 0.276inch; Width: 4.1mm; Height: 0.091inch; Lead Free: Lead Free; ComponentLink1URL: https://datasheet.ciiva.com/852/csm-3x-852331.pdf?src-supplier=Digi-Key; ComponentLink1Description: https://datasheet.ciiva.com/852/csm-3x-852331.pdf?src-supplier=Digi-Key; ComponentLink2URL: https://datasheet.ciiva.com/852/csm-3x-852332.pdf?src-supplier=Digi-Key; ComponentLink2Description: https://datasheet.ciiva.com/852/csm-3x-852332.pdf?src-supplier=Digi-Key; ComponentLink3URL: https://datasheet.ciiva.com/852/csm-3x-852333.pdf?src-supplier=Digi-Key; ComponentLink3Description: https://datasheet.ciiva.com/852/csm-3x-852333.pdf?src-supplier=Digi-Key; Supplier Part Number 1: XC1770CT-ND